# Altium schematic sheet 0066_LLKB_CONNECTOR.SchDoc
size 848 x 558 mm
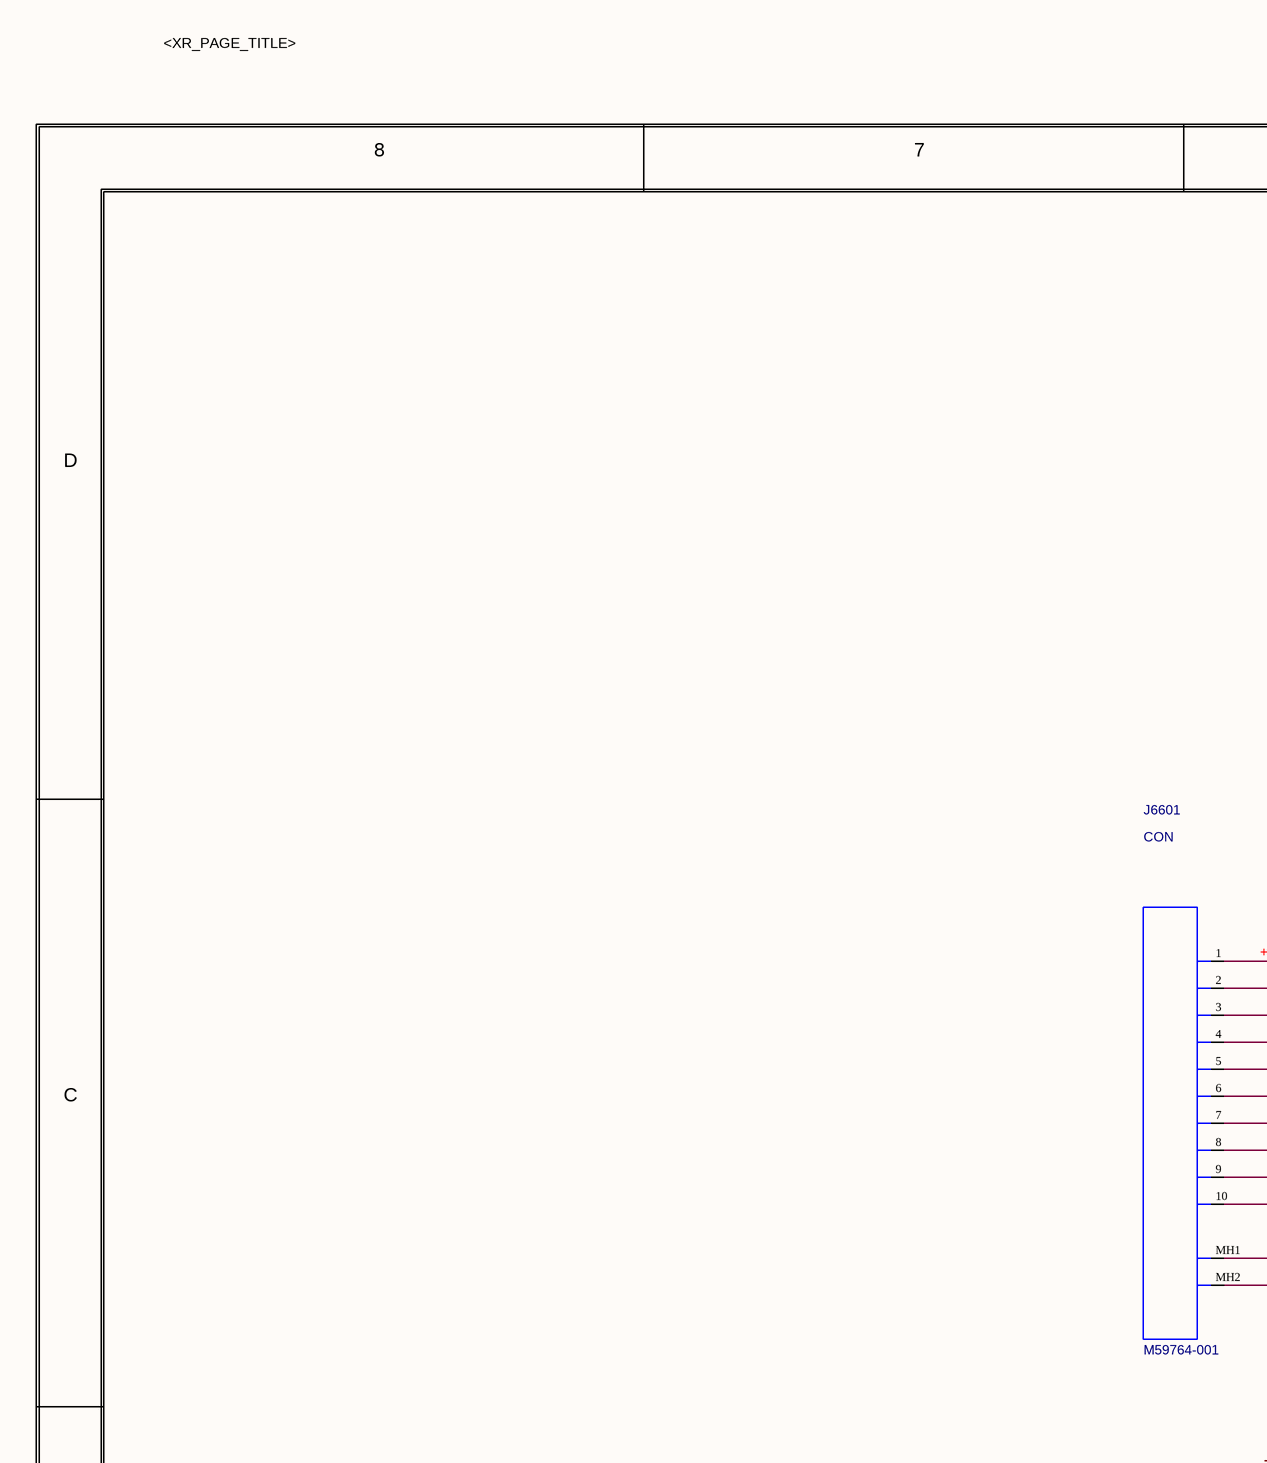
[diagram p0: 0066_LLKB_CONNECTOR.SchDoc, top left]
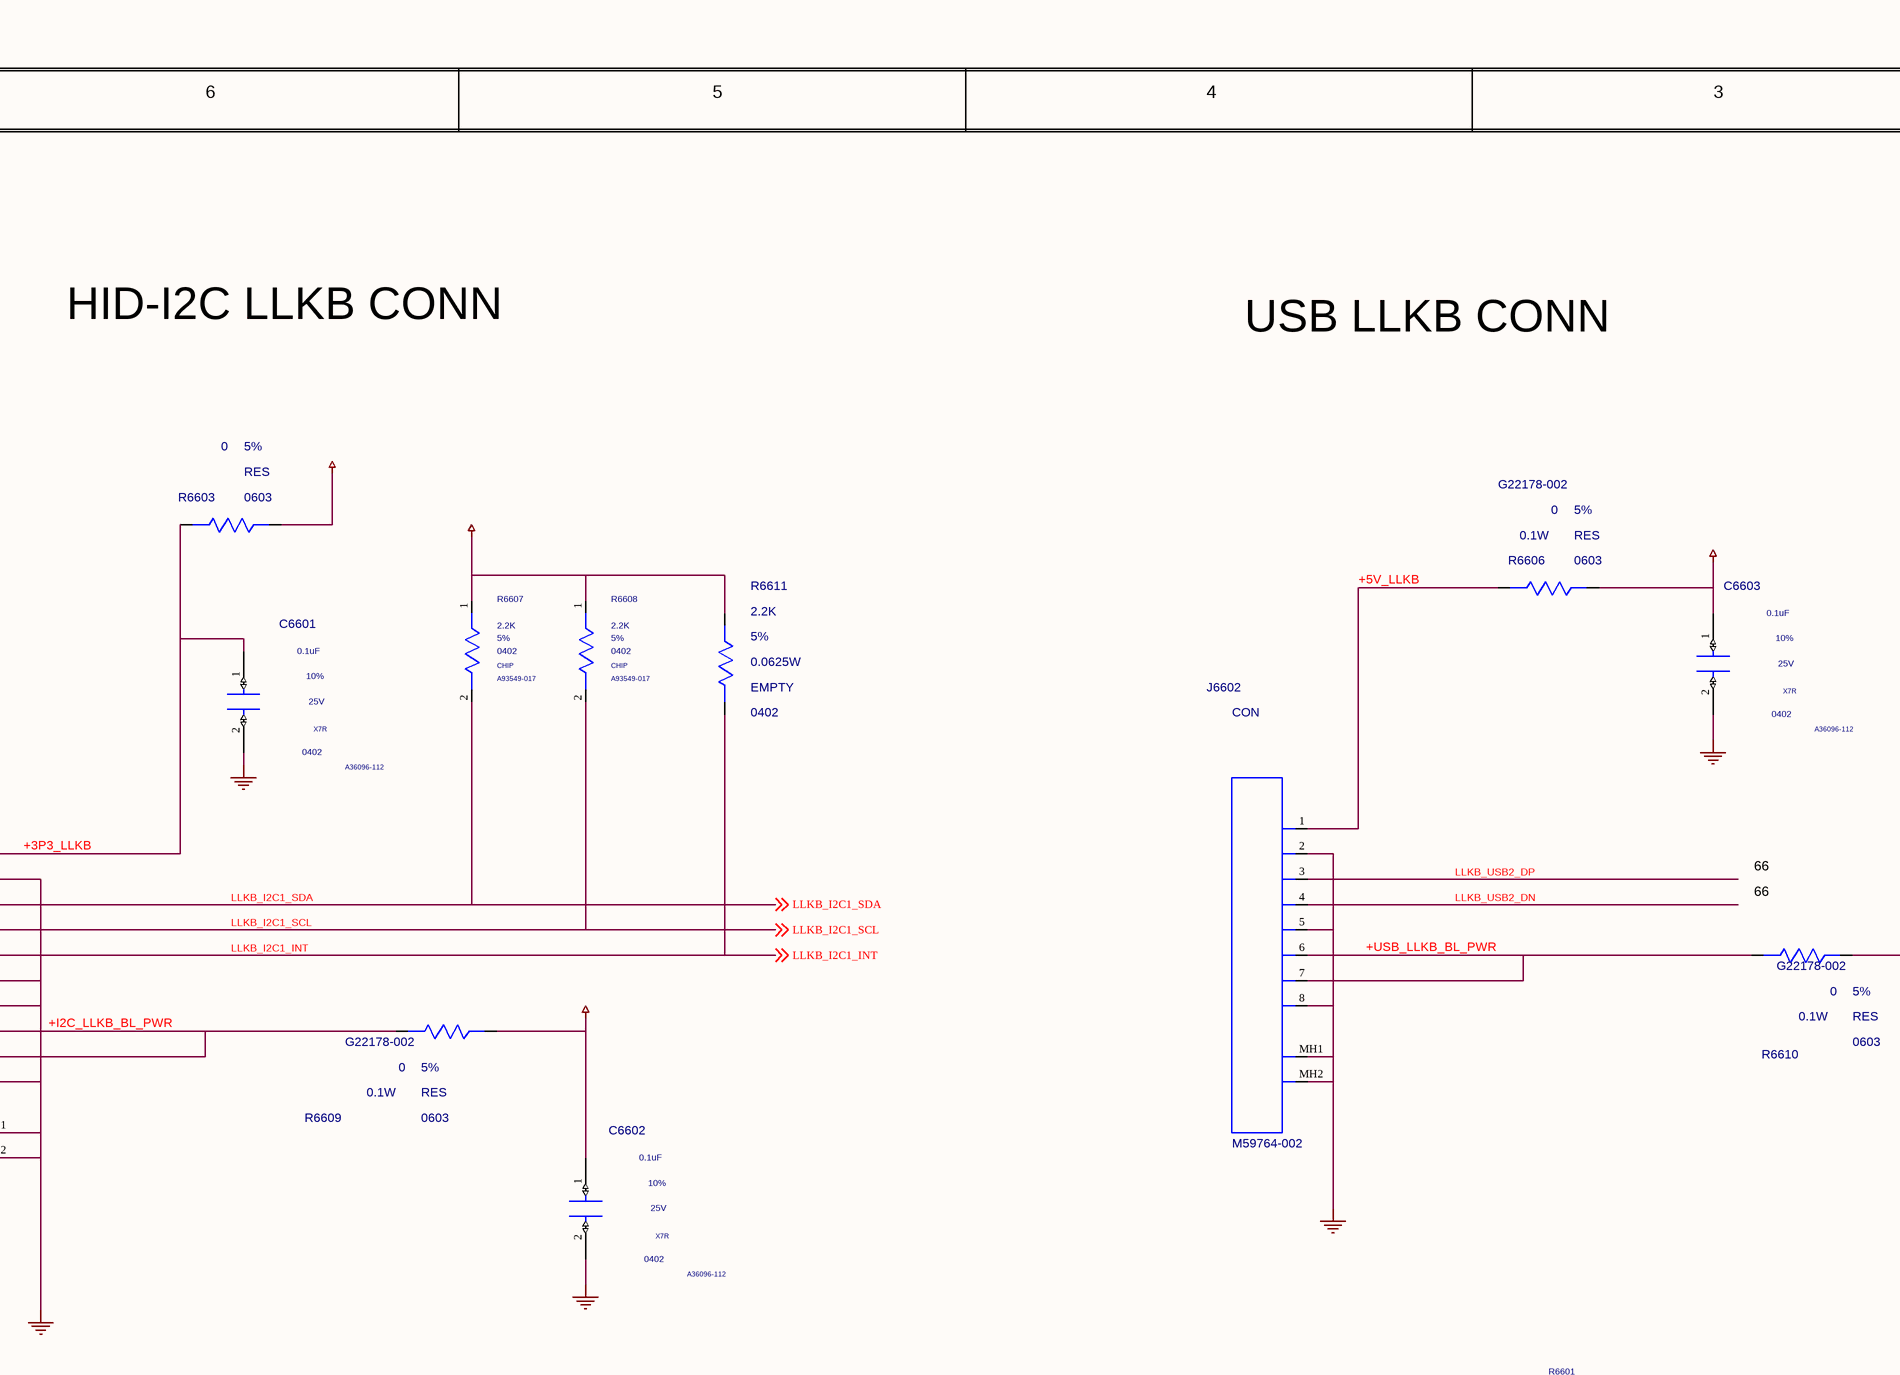
[diagram p1: 0066_LLKB_CONNECTOR.SchDoc, top middle]
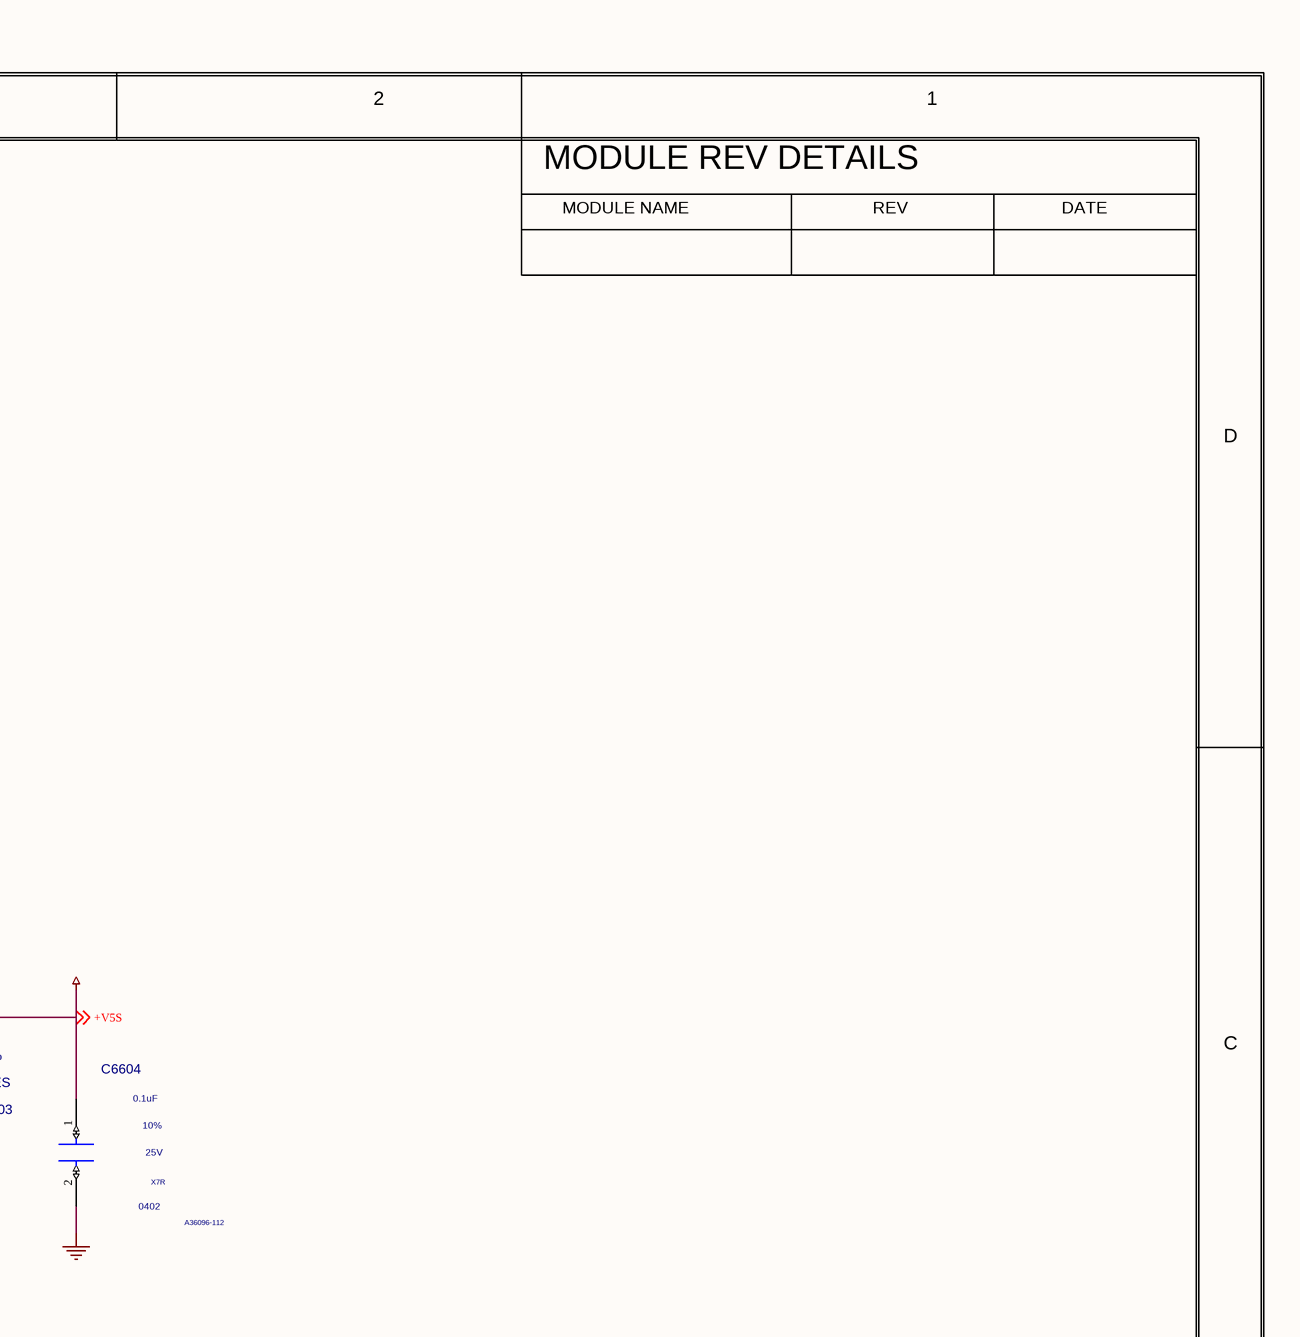
[diagram p2: 0066_LLKB_CONNECTOR.SchDoc, top right]
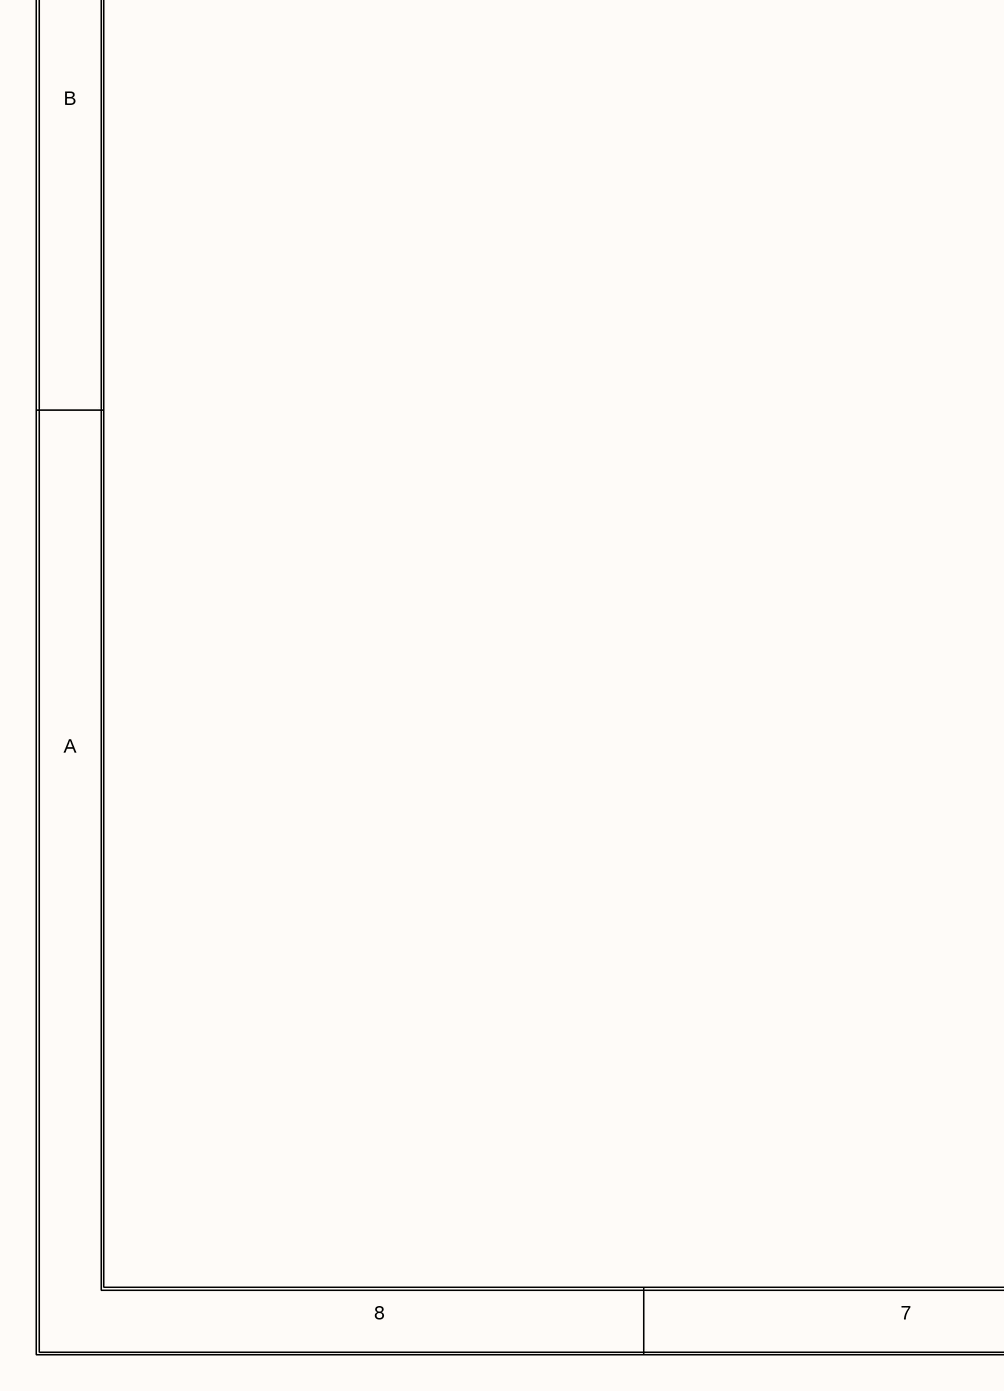
[diagram p3: 0066_LLKB_CONNECTOR.SchDoc, bottom left]
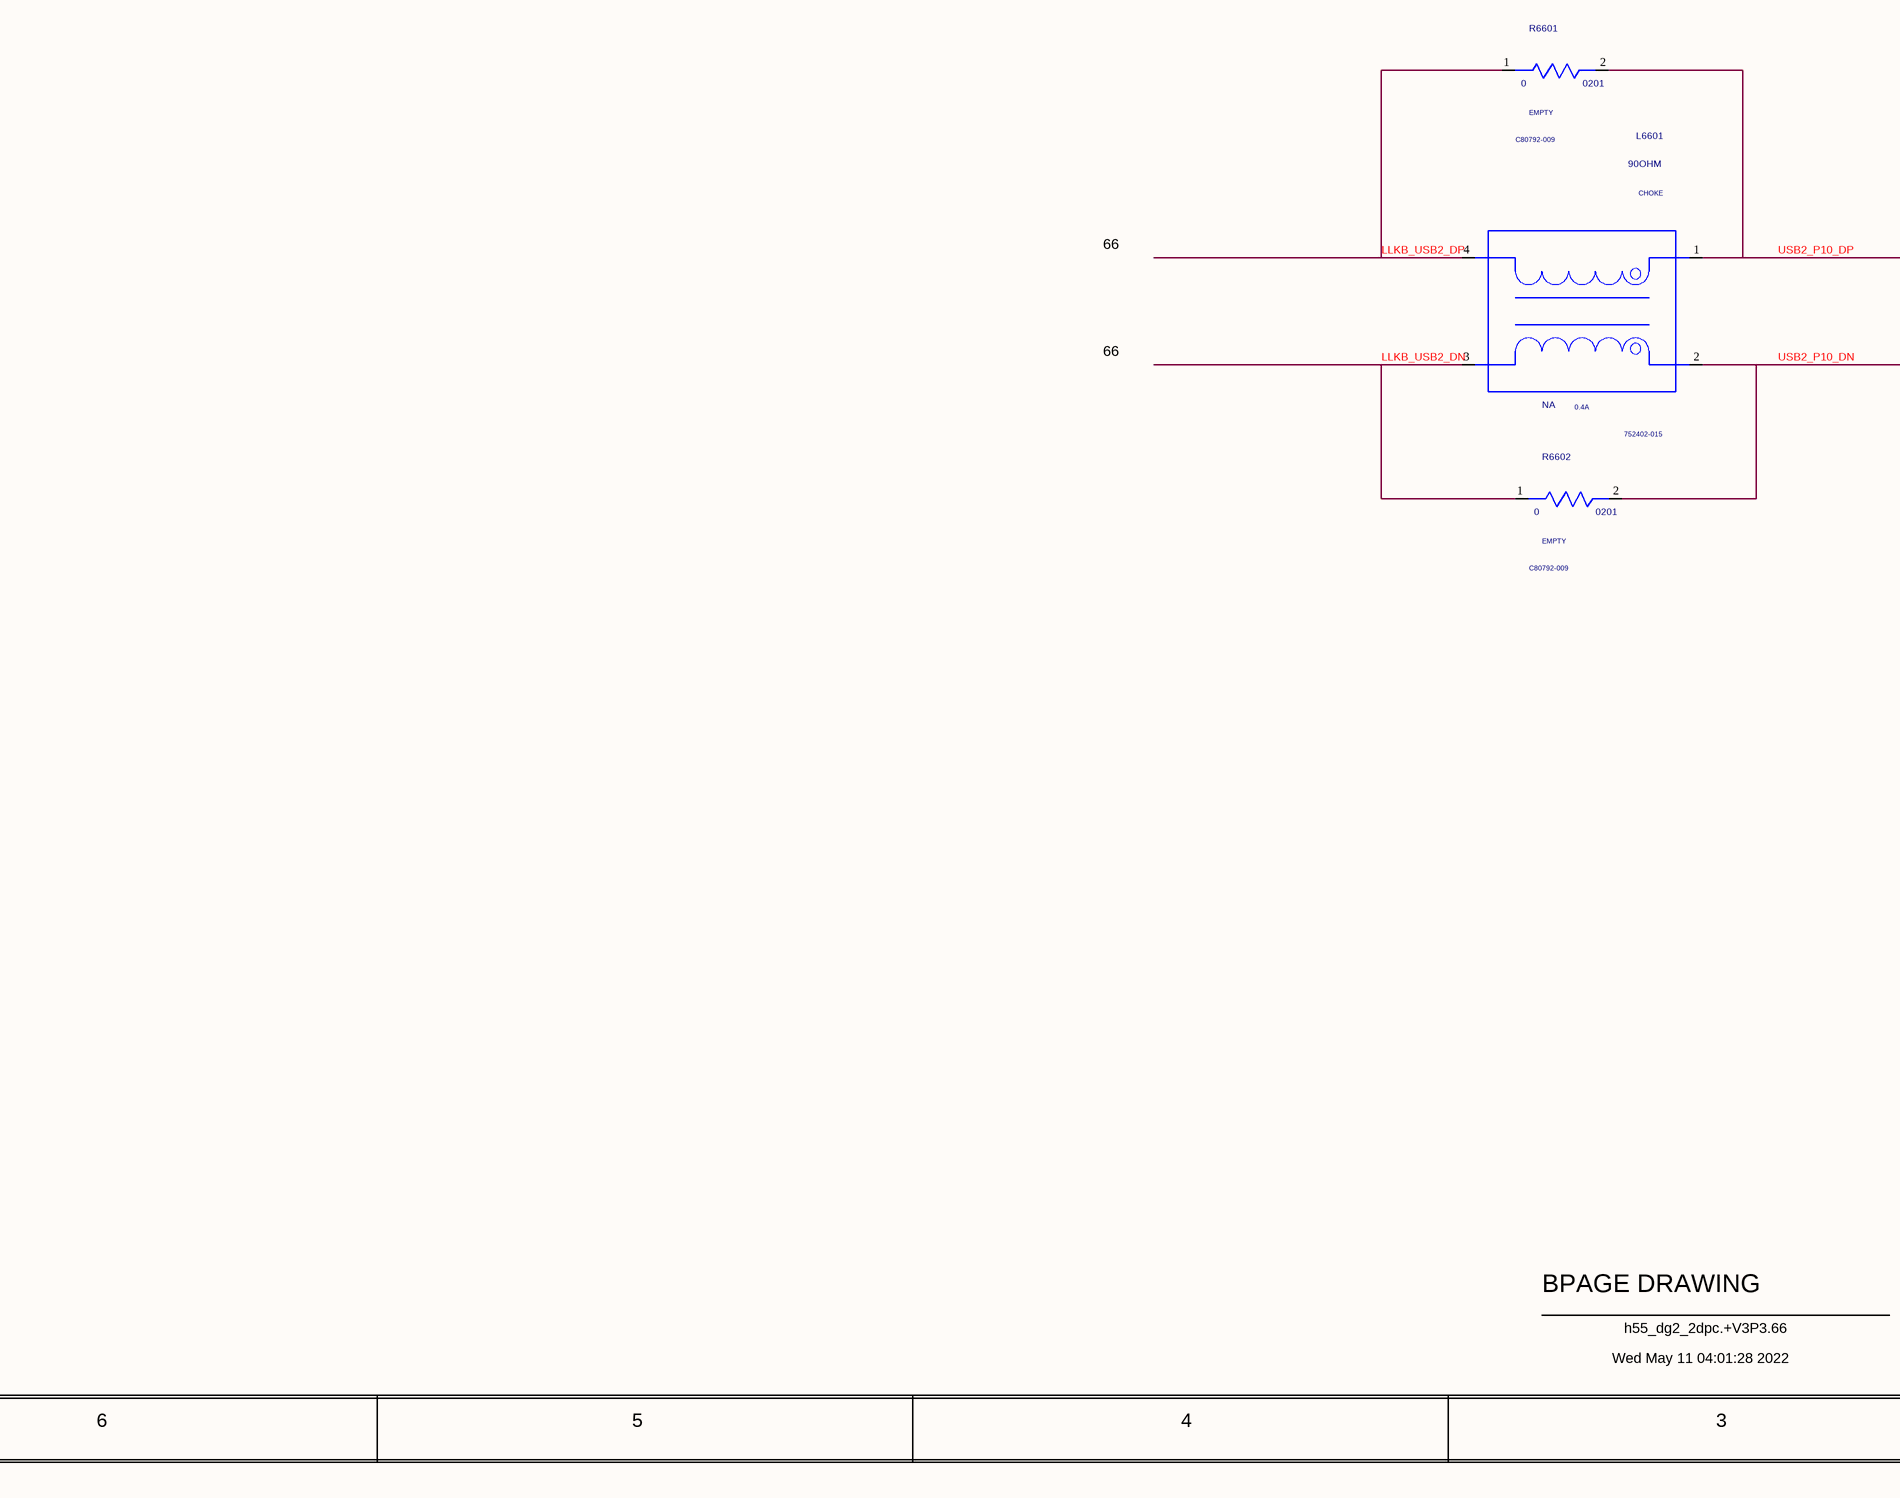
[diagram p4: 0066_LLKB_CONNECTOR.SchDoc, bottom middle]
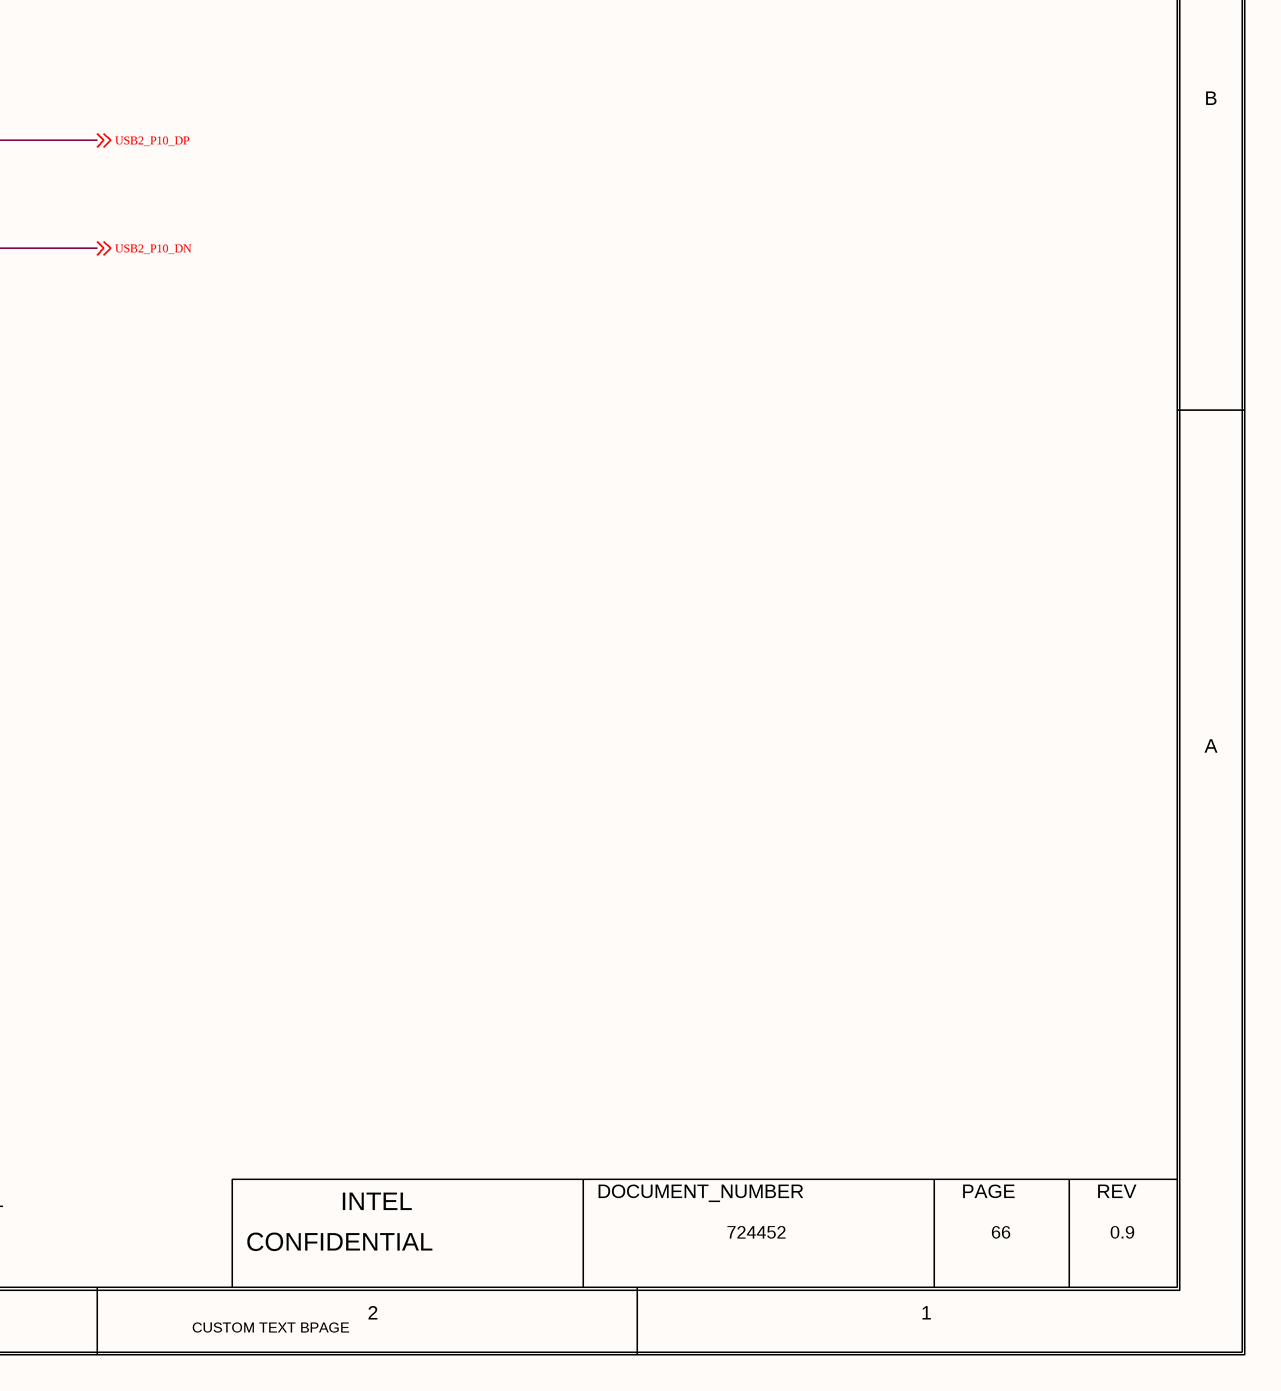
[diagram p5: 0066_LLKB_CONNECTOR.SchDoc, bottom right]

## Parts
C6601  0.1uF  MATERIAL: X7R  PACK_TYPE: 0402  PART_NUMBER: A36096-112  TOLERANCE: 10%  VOLTAGE: 25V  [SMC0402IA]
C6602  0.1uF  MATERIAL: X7R  PACK_TYPE: 0402  PART_NUMBER: A36096-112  TOLERANCE: 10%  VOLTAGE: 25V  [SMC0402IA]
C6603  0.1uF  MATERIAL: X7R  PACK_TYPE: 0402  PART_NUMBER: A36096-112  TOLERANCE: 10%  VOLTAGE: 25V  [SMC0402IA]
C6604  0.1uF  MATERIAL: X7R  PACK_TYPE: 0402  PART_NUMBER: A36096-112  TOLERANCE: 10%  VOLTAGE: 25V  [SMC0402IA]
J6601  MATERIAL: CON  PART_NUMBER: M59764-001  [CTK0_B2B_SJR_1X10_2EM_500_MC_VR]  (hidden comment: C_B2B_1X10_2EM)
J6602  MATERIAL: CON  PART_NUMBER: M59764-002  [CTK0_B2B_SJR_1X8_2EM_500_MB_VR]  (hidden comment: C_B2B_1X8_2EM)
L6601  90OHM  CURRENT: 0.4A  MATERIAL: CHOKE  PART_NUMBER: 752402-015  TOLERANCE: NA  [SMI4_79X47IA]
R6601  0  MATERIAL: EMPTY  PACK_TYPE: 0201  PART_NUMBER: C80792-009  [SMR0201IA]
R6602  0  MATERIAL: EMPTY  PACK_TYPE: 0201  PART_NUMBER: C80792-009  [SMR0201IA]
R6603  0  MATERIAL: RES  PACK_TYPE: 0603  TOLERANCE: 5%  [CTK0_SM0603_1700X950_MA]
R6606  0  MATERIAL: RES  PACK_TYPE: 0603  PART_NUMBER: G22178-002  TOLERANCE: 5%  WATTAGE: 0.1W  [CTK0_SM0603_1700X950_MA]
R6607  2.2K  MATERIAL: CHIP  PACK_TYPE: 0402  PART_NUMBER: A93549-017  TOLERANCE: 5%  [SMR0402IA]
R6608  2.2K  MATERIAL: CHIP  PACK_TYPE: 0402  PART_NUMBER: A93549-017  TOLERANCE: 5%  [SMR0402IA]
R6609  0  MATERIAL: RES  PACK_TYPE: 0603  PART_NUMBER: G22178-002  TOLERANCE: 5%  WATTAGE: 0.1W  [CTK0_SM0603_1700X950_MA]
R6610  0  MATERIAL: RES  PACK_TYPE: 0603  PART_NUMBER: G22178-002  TOLERANCE: 5%  WATTAGE: 0.1W  [CTK0_SM0603_1700X950_MA]
R6611  2.2K  MATERIAL: EMPTY  PACK_TYPE: 0402  TOLERANCE: 5%  WATTAGE: 0.0625W  [CTK2_SM0402_1050X550_MA]

## Nets
+V3P3A_CLICK_PAD: R6607.1(A) R6608.1(A) R6611.1(A)
+V3P3A_KBC: R6603.2(B)
+V5S: C6602.1(A) C6603.1(A) C6604.1(A) R6606.2(B) R6609.2(B) R6610.2(B) ; off-sheet +V5S
GND: C6601.2(B) C6602.2(B) C6603.2(B) C6604.2(B) J6601.2(IO2) J6601.6(IO6) J6601.7(IO7) J6601.10(IO10) J6601.MH1 J6601.MH2 J6602.2(IO2) J6602.5(IO5) J6602.8(IO8) J6602.MH1 J6602.MH2
+3P3_LLKB: C6601.1(A) J6601.1(IO1) R6603.1(A)
+5V_LLKB: J6602.1(IO1) R6606.1(A)
+I2C_LLKB_BL_PWR: J6601.8(IO8) J6601.9(IO9) R6609.1(A)
+USB_LLKB_BL_PWR: J6602.6(IO6) J6602.7(IO7) R6610.1(A)
LLKB_I2C1_INT: J6601.5(IO5) R6611.2(B) ; off-sheet LLKB_I2C1_INT
LLKB_I2C1_SCL: J6601.4(IO4) R6608.2(B) ; off-sheet LLKB_I2C1_SCL
LLKB_I2C1_SDA: J6601.3(IO3) R6607.2(B) ; off-sheet LLKB_I2C1_SDA
LLKB_USB2_DN: J6602.4(IO4) L6601.3(IN_2) R6602.1(A)
LLKB_USB2_DP: J6602.3(IO3) L6601.4(OUT_1) R6601.1(A)
USB2_P10_DN: L6601.2(OUT_2) R6602.2(B) ; off-sheet USB2_P10_DN
USB2_P10_DP: L6601.1(IN_1) R6601.2(B) ; off-sheet USB2_P10_DP

## Notes on the sheet
- <XR_PAGE_TITLE>
- 8
- 7
- 6
- 5
- 4
- 3
- 2
- 1
- MODULE REV DETAILS
- MODULE NAME
- REV
- DATE
- HID-I2C LLKB CONN
- USB LLKB CONN
- D
- 66
- C
- B
- A
- BPAGE DRAWING
- INTEL
- DOCUMENT_NUMBER
- PAGE
- Wed May 11 04:01:28 2022
- h55_dg2_2dpc.+V3P3.66
- CONFIDENTIAL
- 724452
- 0.9
- CUSTOM TEXT BPAGE

## Library data of the parts
C6601 = CAP: CDS_PHYS_PART_NAME: CAP_0402-A36096-112,X7R,0.1UF,25V,10%,LPDB,GENERIC; OriginalSymbolOrigin: (-50,25); XY: (-5425,3875); VER: 1; ROT: 2; PHYS_PAGE: 66; LOCATION: C6601; IP: GENERIC; FP_TECH: LPDB; DRAWING: @RVP1_ADL_SB_ADP_S_DDR5_SODIMM_2DPC_LIB.H55_DG2_2DPC(SCH_1):PAGE66; CDS_LIB: discrete; PCB Footprint: SMC0402IA; CHIPS_PART_NAME: CAP; CDS_PART_NAME: CAP_0402-A36096-112,X7R,0.1UF,25V,10%,LPDB,GENERIC; CDS_LOCATION: C6601; ASI_MODEL: A36096-112
C6602 = CAP: CDS_PHYS_PART_NAME: CAP_0402-A36096-112,X7R,0.1UF,25V,10%,LPDB,GENERIC; OriginalSymbolOrigin: (-50,25); XY: (-4750,2875); VER: 1; ROT: 2; PHYS_PAGE: 66; LOCATION: C6602; IP: GENERIC; FP_TECH: LPDB; DRAWING: @RVP1_ADL_SB_ADP_S_DDR5_SODIMM_2DPC_LIB.H55_DG2_2DPC(SCH_1):PAGE66; CDS_LIB: discrete; PCB Footprint: SMC0402IA; CHIPS_PART_NAME: CAP; CDS_PART_NAME: CAP_0402-A36096-112,X7R,0.1UF,25V,10%,LPDB,GENERIC; CDS_LOCATION: C6602; ASI_MODEL: A36096-112
C6603 = CAP: CDS_PHYS_PART_NAME: CAP_0402-A36096-112,X7R,0.1UF,25V,10%,LPDB,GENERIC; OriginalSymbolOrigin: (-50,25); XY: (-2525,3950); VER: 1; ROT: 2; PHYS_PAGE: 66; LOCATION: C6603; IP: GENERIC; FP_TECH: LPDB; DRAWING: @RVP1_ADL_SB_ADP_S_DDR5_SODIMM_2DPC_LIB.H55_DG2_2DPC(SCH_1):PAGE66; CDS_LIB: discrete; PCB Footprint: SMC0402IA; CHIPS_PART_NAME: CAP; CDS_PART_NAME: CAP_0402-A36096-112,X7R,0.1UF,25V,10%,LPDB,GENERIC; CDS_LOCATION: C6603; ASI_MODEL: A36096-112
C6604 = CAP: CDS_PHYS_PART_NAME: CAP_0402-A36096-112,X7R,0.1UF,25V,10%,LPDB,GENERIC; OriginalSymbolOrigin: (-50,25); XY: (-2075,3125); VER: 1; ROT: 2; PHYS_PAGE: 66; LOCATION: C6604; IP: GENERIC; FP_TECH: LPDB; DRAWING: @RVP1_ADL_SB_ADP_S_DDR5_SODIMM_2DPC_LIB.H55_DG2_2DPC(SCH_1):PAGE66; CDS_LIB: discrete; PCB Footprint: SMC0402IA; CHIPS_PART_NAME: CAP; CDS_PART_NAME: CAP_0402-A36096-112,X7R,0.1UF,25V,10%,LPDB,GENERIC; CDS_LOCATION: C6604; ASI_MODEL: A36096-112
J6601 = C_B2B_1X10_2EM: CDS_PHYS_PART_NAME: C_B2B_1X10_2EM_SM-M59764-001,CON,B2B_1X10_2EM,TK0,GENERIC; CDS_LMAN_SYM_OUTLINE: -50,400,50,-400; FP_TECH: TK0; IP: GENERIC; PACK_TYPE: SM; ROOM: NONE; OriginalSymbolOrigin: (-50,400); XY: (-6025,3275); VER: 1; ROT: 0; PHYS_PAGE: 66; LOCATION: J6601; DRAWING: @RVP1_ADL_SB_ADP_S_DDR5_SODIMM_2DPC_LIB.H55_DG2_2DPC(SCH_1):PAGE66; CDS_LIB: local; VARIANT: ?; PCB Footprint: CTK0_B2B_SJR_1X10_2EM_500_MC_VR; CHIPS_PART_NAME: C_B2B_1X10_2EM; CDS_PART_NAME: C_B2B_1X10_2EM_SM-M59764-001,CON,B2B_1X10_2EM,TK0,GENERIC; CDS_LOCATION: J6601
J6602 = C_B2B_1X8_2EM: CDS_PHYS_PART_NAME: C_B2B_1X8_2EM_SM-M59764-002,CON,B2B_1X8_2EM,TK0,GENERIC; CDS_LMAN_SYM_OUTLINE: -50,350,50,-350; FP_TECH: TK0; IP: GENERIC; PACK_TYPE: SM; ROOM: NONE; OriginalSymbolOrigin: (-50,350); XY: (-3425,3375); VER: 1; ROT: 0; PHYS_PAGE: 66; LOCATION: J6602; DRAWING: @RVP1_ADL_SB_ADP_S_DDR5_SODIMM_2DPC_LIB.H55_DG2_2DPC(SCH_1):PAGE66; CDS_LIB: local; VARIANT: ?; PCB Footprint: CTK0_B2B_SJR_1X8_2EM_500_MB_VR; CHIPS_PART_NAME: C_B2B_1X8_2EM; CDS_PART_NAME: C_B2B_1X8_2EM_SM-M59764-002,CON,B2B_1X8_2EM,TK0,GENERIC; CDS_LOCATION: J6602
L6601 = IND_4PIN: CDS_PHYS_PART_NAME: IND_4PIN_0805-752402-015,CHOKE,90OHM,NA,0.4A,LPDB,GENERIC; CDS_LMAN_SYM_OUTLINE: -200,150,150,-150; PACK_TYPE: 0805; OriginalSymbolOrigin: (-225,150); XY: (-2775,2025); VER: 2; PHYS_PAGE: 66; LOCATION: L6601; IP: GENERIC; FP_TECH: LPDB; DRAWING: @RVP1_ADL_SB_ADP_S_DDR5_SODIMM_2DPC_LIB.H55_DG2_2DPC(SCH_1):PAGE66; CDS_LIB: discrete; PCB Footprint: SMI4_79X47IA; SEC_TYPE: 0805; ROT: 2; CHIPS_PART_NAME: IND_4PIN; CDS_PART_NAME: IND_4PIN_0805-752402-015,CHOKE,90OHM,NA,0.4A,LPDB,GENERIC; CDS_LOCATION: L6601
R6601 = RES#1: CHIPS_PART_NAME: RES; CDS_PHYS_PART_NAME: RES_0201-C80792-009,EMPTY,0,5%,1/20W,LPDB,GENERIC; TOLERANCE: 5%; WATTAGE: 1/20W; OriginalSymbolOrigin: (-75,25); XY: (-2800,2475); VER: 1; ROOM: ROOM_PROP_TEST_178; PHYS_PAGE: 66; LOCATION: R6601; IP: GENERIC; FP_TECH: LPDB; DRAWING: @RVP1_ADL_SB_ADP_S_DDR5_SODIMM_2DPC_LIB.H55_DG2_2DPC(SCH_1):PAGE66; CDS_LIB: discrete; PCB Footprint: SMR0201IA; ROT: 0; CDS_PART_NAME: RES_0201-C80792-009,EMPTY,0,5%,1/20W,LPDB,GENERIC; CDS_LOCATION: R6601
R6602 = RES#1: CHIPS_PART_NAME: RES; CDS_PHYS_PART_NAME: RES_0201-C80792-009,EMPTY,0,5%,1/20W,LPDB,GENERIC; TOLERANCE: 5%; WATTAGE: 1/20W; OriginalSymbolOrigin: (-75,25); XY: (-2775,1675); VER: 1; ROOM: ROOM_PROP_TEST_178; PHYS_PAGE: 66; LOCATION: R6602; IP: GENERIC; FP_TECH: LPDB; DRAWING: @RVP1_ADL_SB_ADP_S_DDR5_SODIMM_2DPC_LIB.H55_DG2_2DPC(SCH_1):PAGE66; CDS_LIB: discrete; PCB Footprint: SMR0201IA; ROT: 0; CDS_PART_NAME: RES_0201-C80792-009,EMPTY,0,5%,1/20W,LPDB,GENERIC; CDS_LOCATION: R6602
R6603 = C_RES#1: PART_NUMBER: G22178-002; CHIPS_PART_NAME: C_RES; CDS_PHYS_PART_NAME: C_RES_0603-G22178-002,RES,0,5%,0.1W,TK0,GENERIC; CDS_LMAN_SYM_OUTLINE: -50,50,50,-50; FP_TECH: TK0; IP: GENERIC; ROOM: NONE; WATTAGE: 0.1W; OriginalSymbolOrigin: (-75,25); XY: (-5450,4225); VER: 1; PHYS_PAGE: 66; LOCATION: R6603; DRAWING: @RVP1_ADL_SB_ADP_S_DDR5_SODIMM_2DPC_LIB.H55_DG2_2DPC(SCH_1):PAGE66; CDS_LIB: c_discrete; VARIANT: ?; PCB Footprint: CTK0_SM0603_1700X950_MA; ROT: 0; CDS_PART_NAME: C_RES_0603-G22178-002,RES,0,5%,0.1W,TK0,GENERIC; CDS_LOCATION: R6603
R6606 = C_RES#1: CHIPS_PART_NAME: C_RES; CDS_PHYS_PART_NAME: C_RES_0603-G22178-002,RES,0,5%,0.1W,TK0,GENERIC; CDS_LMAN_SYM_OUTLINE: -50,50,50,-50; FP_TECH: TK0; IP: GENERIC; ROOM: NONE; OriginalSymbolOrigin: (-75,25); XY: (-2850,4100); VER: 1; PHYS_PAGE: 66; LOCATION: R6606; DRAWING: @RVP1_ADL_SB_ADP_S_DDR5_SODIMM_2DPC_LIB.H55_DG2_2DPC(SCH_1):PAGE66; CDS_LIB: c_discrete; VARIANT: ?; PCB Footprint: CTK0_SM0603_1700X950_MA; ROT: 0; CDS_PART_NAME: C_RES_0603-G22178-002,RES,0,5%,0.1W,TK0,GENERIC; CDS_LOCATION: R6606
R6607 = RES: CDS_PHYS_PART_NAME: RES_0402-A93549-017,CHIP,2.2K,5%,1/16W,LPDB,GENERIC; WATTAGE: 1/16W; OriginalSymbolOrigin: (-25,75); XY: (-4975,3975); VER: 2; ROT: 0; PHYS_PAGE: 66; LOCATION: R6607; IP: GENERIC; FP_TECH: LPDB; FIN: PCH; DRAWING: @RVP1_ADL_SB_ADP_S_DDR5_SODIMM_2DPC_LIB.H55_DG2_2DPC(SCH_1):PAGE66; CDS_LIB: discrete; PCB Footprint: SMR0402IA; CHIPS_PART_NAME: RES; CDS_PART_NAME: RES_0402-A93549-017,CHIP,2.2K,5%,1/16W,LPDB,GENERIC; CDS_LOCATION: R6607; ASI_MODEL: A93549-017
R6608 = RES: CDS_PHYS_PART_NAME: RES_0402-A93549-017,CHIP,2.2K,5%,1/16W,LPDB,GENERIC; WATTAGE: 1/16W; OriginalSymbolOrigin: (-25,75); XY: (-4750,3975); VER: 2; ROT: 0; PHYS_PAGE: 66; LOCATION: R6608; IP: GENERIC; FP_TECH: LPDB; FIN: PCH; DRAWING: @RVP1_ADL_SB_ADP_S_DDR5_SODIMM_2DPC_LIB.H55_DG2_2DPC(SCH_1):PAGE66; CDS_LIB: discrete; PCB Footprint: SMR0402IA; CHIPS_PART_NAME: RES; CDS_PART_NAME: RES_0402-A93549-017,CHIP,2.2K,5%,1/16W,LPDB,GENERIC; CDS_LOCATION: R6608; ASI_MODEL: A93549-017
R6609 = C_RES#1: CHIPS_PART_NAME: C_RES; CDS_PHYS_PART_NAME: C_RES_0603-G22178-002,RES,0,5%,0.1W,TK0,GENERIC; CDS_LMAN_SYM_OUTLINE: -50,50,50,-50; FP_TECH: TK0; IP: GENERIC; ROOM: NONE; OriginalSymbolOrigin: (-75,25); XY: (-5025,3225); VER: 1; PHYS_PAGE: 66; LOCATION: R6609; DRAWING: @RVP1_ADL_SB_ADP_S_DDR5_SODIMM_2DPC_LIB.H55_DG2_2DPC(SCH_1):PAGE66; CDS_LIB: c_discrete; VARIANT: ?; PCB Footprint: CTK0_SM0603_1700X950_MA; ROT: 0; CDS_PART_NAME: C_RES_0603-G22178-002,RES,0,5%,0.1W,TK0,GENERIC; CDS_LOCATION: R6609
R6610 = C_RES#1: CHIPS_PART_NAME: C_RES; CDS_PHYS_PART_NAME: C_RES_0603-G22178-002,RES,0,5%,0.1W,TK0,GENERIC; CDS_LMAN_SYM_OUTLINE: -50,50,50,-50; FP_TECH: TK0; IP: GENERIC; ROOM: NONE; OriginalSymbolOrigin: (-75,25); XY: (-2350,3375); VER: 1; PHYS_PAGE: 66; LOCATION: R6610; DRAWING: @RVP1_ADL_SB_ADP_S_DDR5_SODIMM_2DPC_LIB.H55_DG2_2DPC(SCH_1):PAGE66; CDS_LIB: c_discrete; VARIANT: ?; PCB Footprint: CTK0_SM0603_1700X950_MA; ROT: 0; CDS_PART_NAME: C_RES_0603-G22178-002,RES,0,5%,0.1W,TK0,GENERIC; CDS_LOCATION: R6610
R6611 = C_RES: PART_NUMBER: G21497-045; CDS_PHYS_PART_NAME: C_RES_0402-G21497-045,EMPTY,2.2K,5%,0.0625W,TK2,GENERIC; CDS_LMAN_SYM_OUTLINE: -50,50,50,-50; FP_TECH: TK2; IP: GENERIC; ROOM: NONE; OriginalSymbolOrigin: (-25,75); XY: (-4475,3950); VER: 2; ROT: 0; PHYS_PAGE: 66; LOCATION: R6611; DRAWING: @RVP1_ADL_SB_ADP_S_DDR5_SODIMM_2DPC_LIB.H55_DG2_2DPC(SCH_1):PAGE66; CDS_LIB: c_discrete; VARIANT: ?; PCB Footprint: CTK2_SM0402_1050X550_MA; CHIPS_PART_NAME: C_RES; CDS_PART_NAME: C_RES_0402-G21497-045,EMPTY,2.2K,5%,0.0625W,TK2,GENERIC; CDS_LOCATION: R6611